# EAGLE schematic ultrasonicsensor4 (EAGLE 8.1.0)
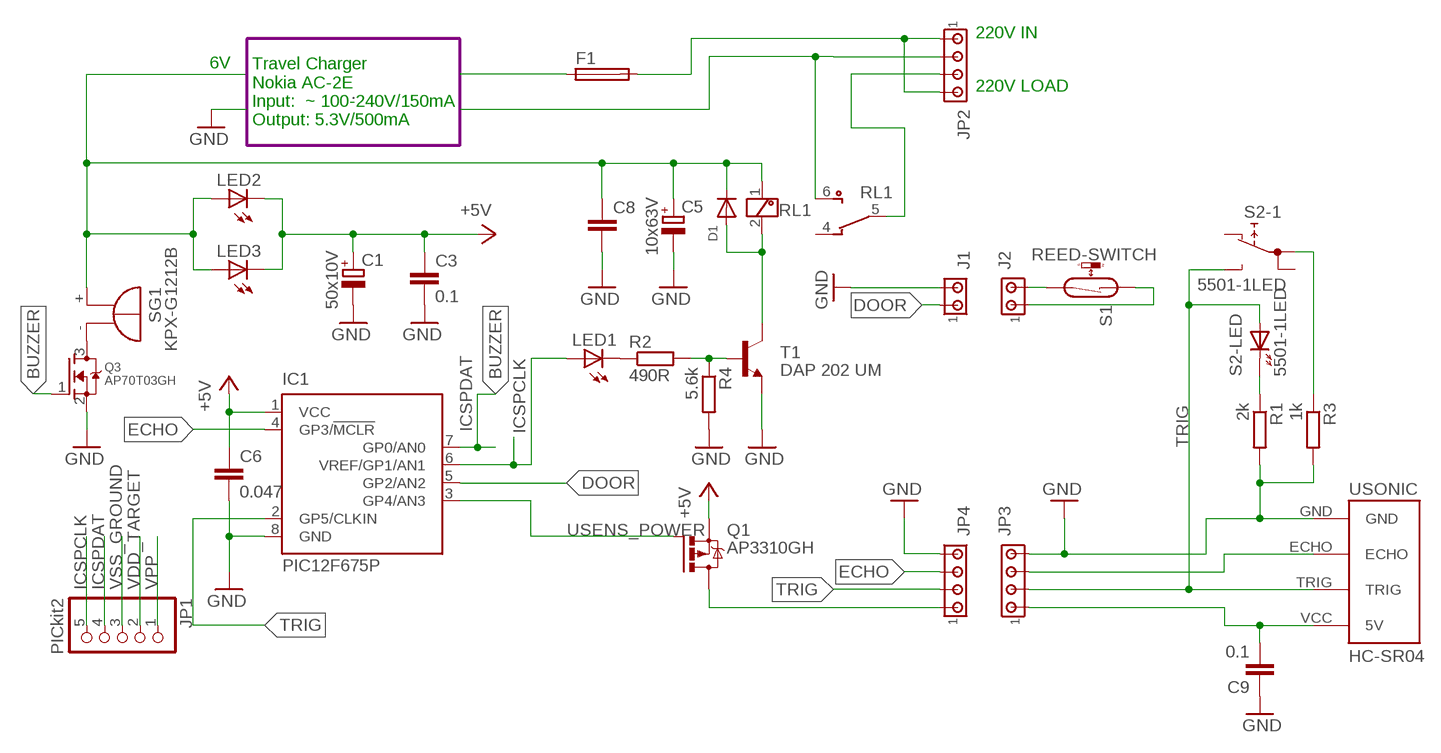
[diagram p0: schematic, sheet 1]

## Parts
C1  50x10V  CPOL-EUC/6032-28R  [C/6032-28R]
C3  0.1  C-EU025-030X050  [C025-030X050]
C5  10x63V  CPOL-EUC/6032-28R  [C/6032-28R]
C6  0.047  C-EU025-030X050  [C025-030X050]
C8  C-EU025-030X050  [C025-030X050]
C9  0.1  C-EU025-030X050  [C025-030X050]
D1  DIODESOD-123  [SOD-123]
F1  SH22,5A  [SH22,5A]
IC1  PIC12F675P  [DIL8]
J1  MTA02-100  [10X02MTA]
J2  MTA02-100  [10X02MTA]
JP1  PICkit2  PINHD-1X5  [1X05]
JP2  MTA04-156  [1X4MTA]
JP3  MTA04-156  [1X4MTA]
JP4  MTA04-156  [1X4MTA]
LED1  LED3MM  [LED3MM]
LED2  LED3MM  [LED3MM]
LED3  LED3MM  [LED3MM]
Q3  AP70T03GH  MOSFET-NREFLOW  [SOT23]
R1  2k  R-EU_0207/2V  [0207/2V]
R2  490R  R-EU_0207/2V  [0207/2V]
R3  1k  R-EU_0207/2V  [0207/2V]
R4  5.6k  R-EU_0207/2V  [0207/2V]
RL1  V23061-B1007-A401 SCHRACK  V23040-A0001-B201  [V23040201]
S1  REED-SWITCH  REED-SWITCH-MK6-5-B  [MK6-5]
S2  5501-1LED  [5501-1LED]
SG1  KPX-G1212B  EB2505  [EB2505]
T1  DAP 202 UM  BC547  [TO92]
USONIC  HC-SR04  [HC-SR04_FOOTPRINT]

## Module instances
. = 1

## Nets
220-1: F1.2 JP2.1 JP2.4
220-2: JP2.2 RL1.6
220-LOAD: JP2.3 RL1.5
+5V: C1.+ C3.1 C6.1 IC1.1(VCC) LED2.K(C) LED3.K(C)
BUZZER: Q3.1(G)
DOOR: J1.1
ECHO: IC1.4(GP3/!MCLR) JP4.3
GND: C1.- C3.2 C5.- C6.2 C8.2 C9.1 IC1.8(GND) J1.2 JP3.4 JP4.4 Q3.2(S) R1.2 R3.2 R4.2 T1.1(E) USONIC.GND
ICSPCLK: IC1.6(VREF/GP1/AN1) JP1.5 LED1.A
ICSPDAT: IC1.7(GP0/AN0) JP1.4
N$1: C5.+ C8.1 D1.C LED2.A LED3.A RL1.1 SG1.+
N$2: JP4.1
N$3: R2.2 R4.1 T1.2(B)
N$4: Q3.3(D) SG1.-
N$5: IC1.5(GP2/AN2)
N$6: LED1.K(C) R2.1
N$7: D1.A RL1.2 T1.3(C)
N$8: J2.1 S1.1
N$9: F1.1
N$10: R1.1 S2.-(-LED:K)
N$11: J2.2 S1.2
N$12: C9.2 JP3.1 USONIC.VCC(5V)
N$13: JP3.3 USONIC.ECHO
N$14: R3.1 S2.1A(-1:1A)
TRIG: IC1.2(GP5/CLKIN) JP3.2 JP4.2 S2.+(-LED:A) S2.NO(-1:NO) USONIC.TRIG
USENS_POWER: IC1.3(GP4/AN3)
VDD_TARGET: JP1.2
VPP: JP1.1
VSS_GROUND: JP1.3
Unconnected: RL1.3 RL1.4 S2.1B(-1:1B) S2.NC(-1:NC)

## Notes on the sheet
- 220V IN
- 6V
- 220V LOAD
- Travel Charger 
  Nokia AC-2E
  Input:  ~ 100-240V/150mA
  Output: 5.3V/500mA

## Library data of the parts
C1 C5 = rcl:CPOL-EU: POLARIZED CAPACITOR, European symbol
C3 C6 C8 C9 = rcl:C-EU: CAPACITOR, European symbol
D1 = adafruit:DIODE: Diode SMADIODE - SMA Surface Mount Package 20V 1A Schottky Diode Digikey: 641-1014-6-ND DO-1N4148 - Through Hole Small Current Diode SOD-123 20V 1 A (.5mV Vf) Schottky Diode - Digikey: MBRX120TPMSCT-ND SOD-323 10V 570mA (.38mV Vf, 3ns) Schottky Diode - Digikey: ZLLS410CT-ND SOD-523 30V 30mA Schottky Diode (RB751S-40TE61) - Digikey: RB751S-40TE61CT-ND SOT23-R/W - SOT23 Package (R = Solder Paste/Reflow Ovens, W = Hand-Soldering) BAT54Film 40V 300mA - Digikey: 497-7162-1-ND
F1 = fuse:SH22,5A: FUSE HOLDER grid 22,5mm, isolated cap OGN0031 8201, Schurter (Buerklin); MPN: 0031.7701.11; OC_FARNELL: unknown; OC_NEWARK: 04F1224
IC1 = microchip:PIC12F675: 8-Pin FLASH-Based 8-Bit CMOS Microcontroller Precision Internal 4 MHz oscillator factory calibrated to ±1% Low Power Features: Standby Current: - 1 nA @ 2.0V, typical Operating Current: - 8.5µA @ 32 kHz, 2.0V, typical - 100µA @ 1 MHz, 2.0V, typical Watchdog Timer Current: - 300 nA @ 2.0V, typical Timer1 oscillator current: - 4µA @ 32 kHz, 2.0V, typical Analog-to-Digital Converter module: - 10-bit resolution - Programmable 4-channel input - Voltage reference input Source: http://www.microchip.com .. 41190E.pdf; MF: MICROCHIP; MPN: PIC12F675-E/P; OC_FARNELL: 9759018; OC_NEWARK: 92C4340
J1 J2 = con-amp:MTA02-100: AMP connector
JP1 = pinhead:PINHD-1X5: PIN HEADER
JP2-JP4 = con-amp:MTA04-156: AMP connector
LED1-LED3 = led:LED: LED OSRAM: - CHIPLED LG R971, LG N971, LY N971, LG Q971, LY Q971, LO R971, LY R971 LH N974, LH R974 LS Q976, LO Q976, LY Q976 LO Q996 - Hyper CHIPLED LW Q18S LB Q993, LB Q99A, LB R99A - SideLED LS A670, LO A670, LY A670, LG A670, LP A670 LB A673, LV A673, LT A673, LW A673 LH A674 LY A675 LS A676, LA A676, LO A676, LY A676, LW A676 LS A679, LY A679, LG A679 - Hyper Micro SIDELED® LS Y876, LA Y876, LO Y876, LY Y876 LT Y87S - SmartLED LW L88C, LW L88S LB L89C, LB L89S, LG L890 LS L89K, LO L89K, LY L89K LS L896, LA L896, LO L896, LY L896 - TOPLED LS T670, LO T670, LY T670, LG T670, LP T670 LSG T670, LSP T670, LSY T670, LOP T670, LYG T670 LG T671, LOG T671, LSG T671 LB T673, LV T673, LT T673, LW T673 LH T674 LS T676, LA T676, LO T676, LY T676, LB T676, LH T676, LSB T676, LW T676 LB T67C, LV T67C, LT T67C, LS T67K, LO T67K, LY T67K, LW E67C LS E67B, LA E67B, LO E67B, LY E67B, LB E67C, LV E67C, LT E67C LW T67C LS T679, LY T679, LG T679 LS T770, LO T770, LY T770, LG T770, LP T770 LB T773, LV T773, LT T773, LW T773 LH T774 LS E675, LA E675, LY E675, LS T675 LS T776, LA T776, LO T776, LY T776, LB T776 LHGB T686 LT T68C, LB T68C - Hyper Mini TOPLED® LB M676 - Mini TOPLED Santana® LG M470 LS M47K, LO M47K, LY M47K Source: http://www.osram.convergy.de LUXEON: - LUMILED® LXK2-PW12-R00, LXK2-PW12-S00, LXK2-PW14-U00, LXK2-PW14-V00 LXK2-PM12-R00, LXK2-PM12-S00, LXK2-PM14-U00 LXK2-PE12-Q00, LXK2-PE12-R00, LXK2-PE12-S00, LXK2-PE14-T00, LXK2-PE14-U00 LXK2-PB12-K00, LXK2-PB12-L00, LXK2-PB12-M00, LXK2-PB14-N00, LXK2-PB14-P00, LXK2-PB14-Q00 LXK2-PR12-L00, LXK2-PR12-M00, LXK2-PR14-Q00, LXK2-PR14-R00 LXK2-PD12-Q00, LXK2-PD12-R00, LXK2-PD12-S00 LXK2-PH12-R00, LXK2-PH12-S00 LXK2-PL12-P00, LXK2-PL12-Q00, LXK2-PL12-R00 Source: www.luxeon.com KINGBRIGHT: KA-3528ASYC Source: www.kingbright.com
Q3 = adafruit:MOSFET-N: N-Channel Mosfet 2N7002E - 60V 260mA SOT23 [Digikey: 2N7002ET1GOSTR-ND] - REEL BSH103 - 30V 850mA SOT23 [Digikey: 568-5013-1-ND]
R1-R4 = rcl:R-EU_: RESISTOR, European symbol
RL1 = relay:V23040-*-B201: SIEMENS Monostabil A0001 = 5V; A0002 = 12V; A0003 = 15V; A0004 = 24V Bistabil C0051 = 5V; C0052 = 12V; OC_FARNELL: unknown; OC_NEWARK: unknown
S1 = switch-reed:REED-SWITCH-: Reed Sensor; MF: MEDER; MPN: MK6-5-B; OC_FARNELL: 1079479
S2 = switch:55?-1LED: PUSHBUTTON SERIES 5500 SWITCHES 1 LED Source: www.e-switch.com .. 5500.pdf
SG1 = buzzer:EB2505: BUZZER Source: Buerklin; OC_FARNELL: unknown; OC_NEWARK: unknown
T1 = transistor:BC547: NPN TRANSISTOR
USONIC = Ultrasonic Sensor HC-SR04:HC-SR04: Ultrasonic Sensor HC-SR04

## Module 1
Ports: 

### Library data of the parts